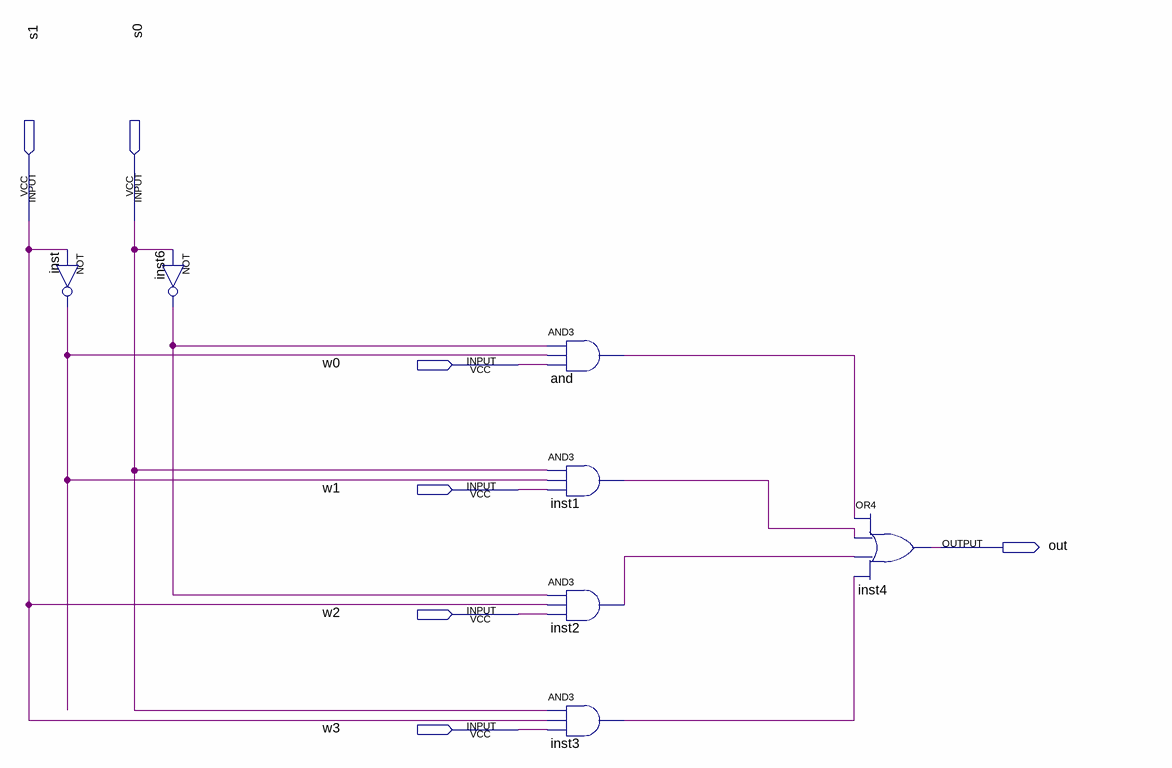
[diagram p0: schematic sheet]
// Quartus schematic 4to1mux.bdf as structural Verilog: 7 symbols, 7 pins
module \4to1mux  (
  input  s1,
  input  s0,
  input  w0,
  input  w1,
  input  w2,
  input  w3,
  output out
);

  wire and_out, inst1_out, inst2_out, inst3_out, inst6_out, inst_out;

  not inst (inst_out, s1);
  not inst6 (inst6_out, s0);
  and \and  (and_out, inst6_out, inst_out, w0);
  and inst1 (inst1_out, s0, inst_out, w1);
  and inst2 (inst2_out, inst6_out, s1, w2);
  and inst3 (inst3_out, s0, s1, w3);
  or inst4 (out, and_out, inst1_out, inst2_out, inst3_out);
endmodule
